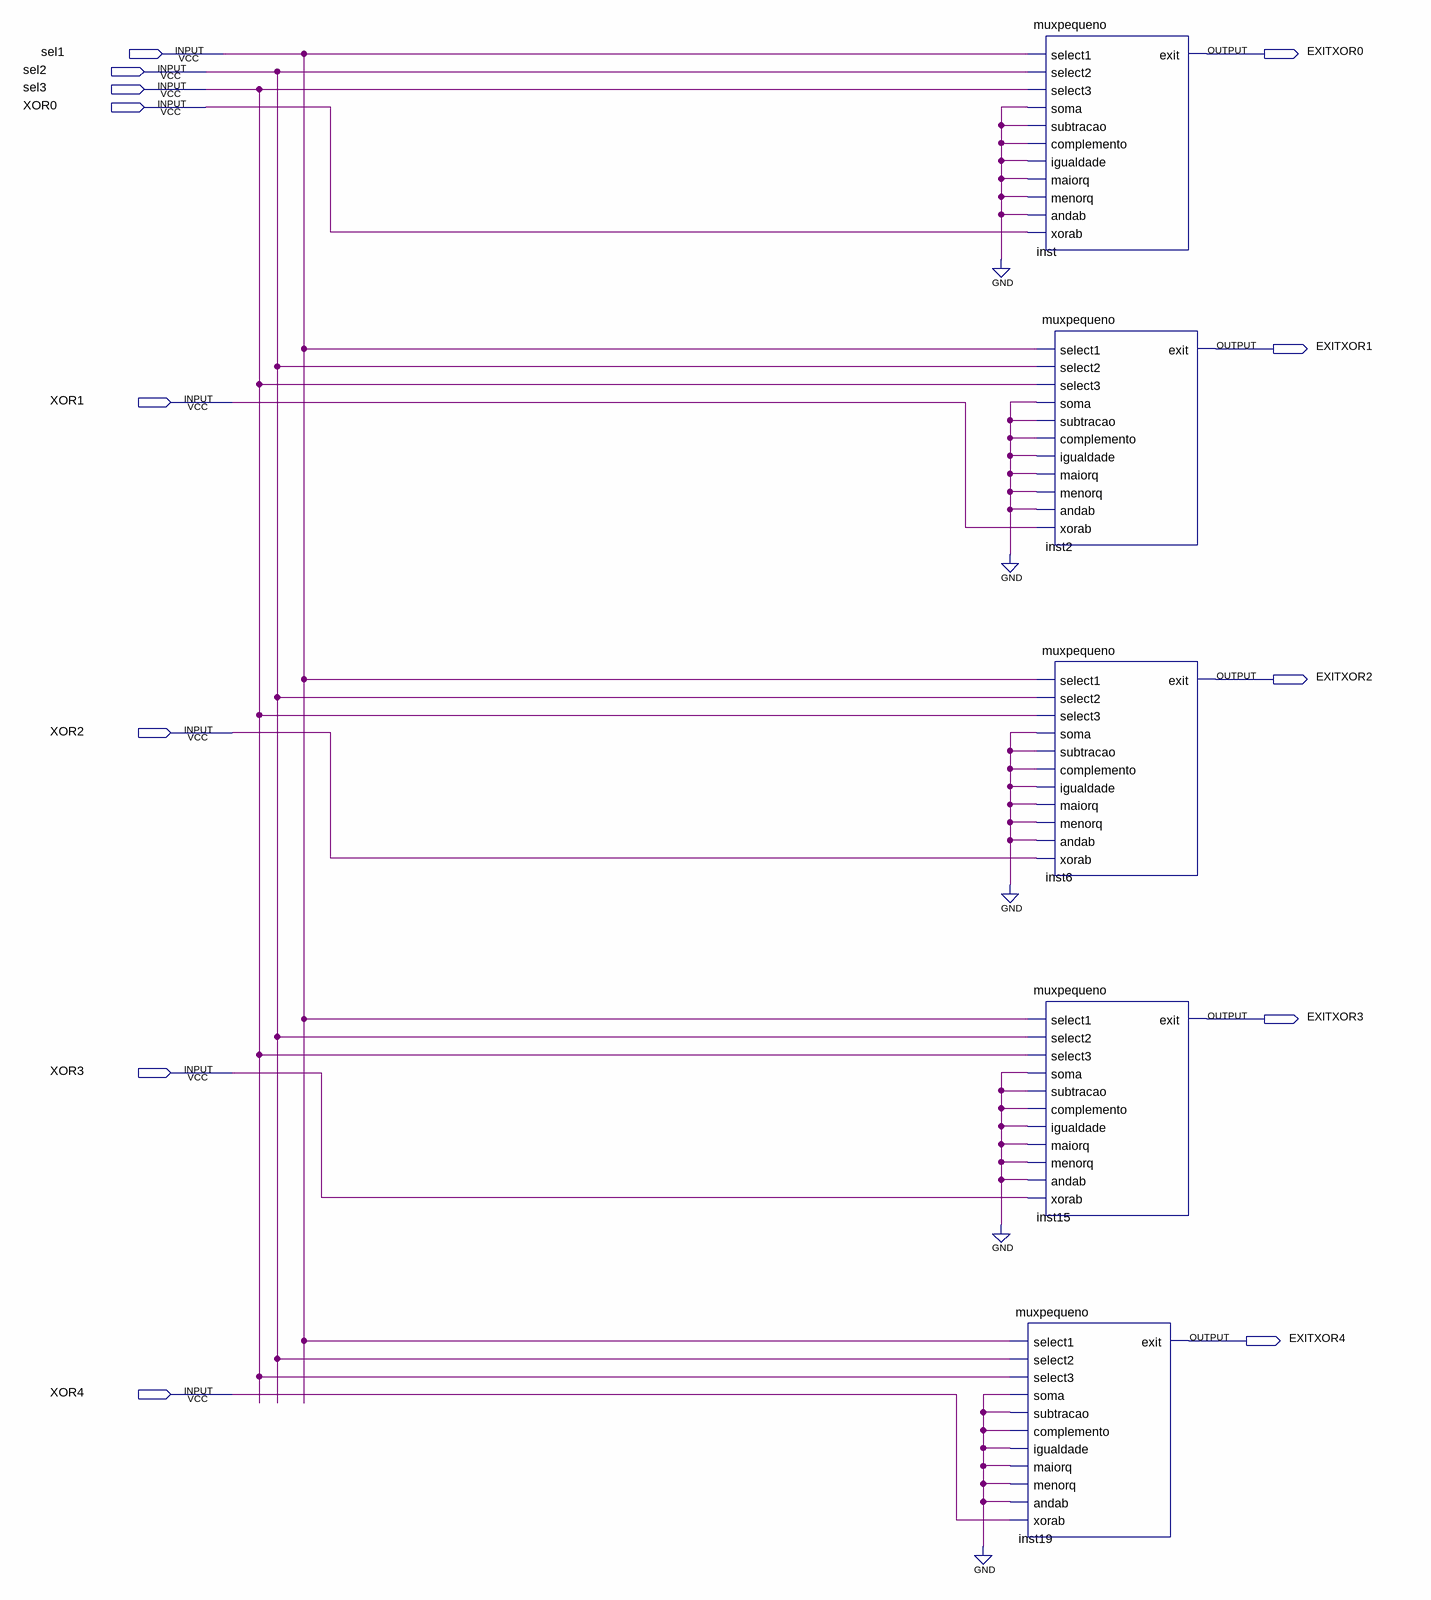
[diagram p0: schematic sheet]
// Quartus schematic MUXXOR.bdf as structural Verilog: 5 symbols, 13 pins
module MUXXOR (
  input  sel1,
  input  sel2,
  input  sel3,
  input  XOR0,
  input  XOR1,
  input  XOR2,
  input  XOR3,
  input  XOR4,
  output EXITXOR0,
  output EXITXOR1,
  output EXITXOR2,
  output EXITXOR3,
  output EXITXOR4
);

  muxpequeno inst (
    .select1(sel1), .select2(sel2), .select3(sel3), .soma(1'b0), .subtracao(1'b0), .complemento(1'b0),
    .igualdade(1'b0), .maiorq(1'b0), .menorq(1'b0), .andab(1'b0), .xorab(XOR0), .exit(EXITXOR0));
  muxpequeno inst2 (
    .select1(sel1), .select2(sel2), .select3(sel3), .soma(1'b0), .subtracao(1'b0), .complemento(1'b0),
    .igualdade(1'b0), .maiorq(1'b0), .menorq(1'b0), .andab(1'b0), .xorab(XOR1), .exit(EXITXOR1));
  muxpequeno inst6 (
    .select1(sel1), .select2(sel2), .select3(sel3), .soma(1'b0), .subtracao(1'b0), .complemento(1'b0),
    .igualdade(1'b0), .maiorq(1'b0), .menorq(1'b0), .andab(1'b0), .xorab(XOR2), .exit(EXITXOR2));
  muxpequeno inst15 (
    .select1(sel1), .select2(sel2), .select3(sel3), .soma(1'b0), .subtracao(1'b0), .complemento(1'b0),
    .igualdade(1'b0), .maiorq(1'b0), .menorq(1'b0), .andab(1'b0), .xorab(XOR3), .exit(EXITXOR3));
  muxpequeno inst19 (
    .select1(sel1), .select2(sel2), .select3(sel3), .soma(1'b0), .subtracao(1'b0), .complemento(1'b0),
    .igualdade(1'b0), .maiorq(1'b0), .menorq(1'b0), .andab(1'b0), .xorab(XOR4), .exit(EXITXOR4));
endmodule
